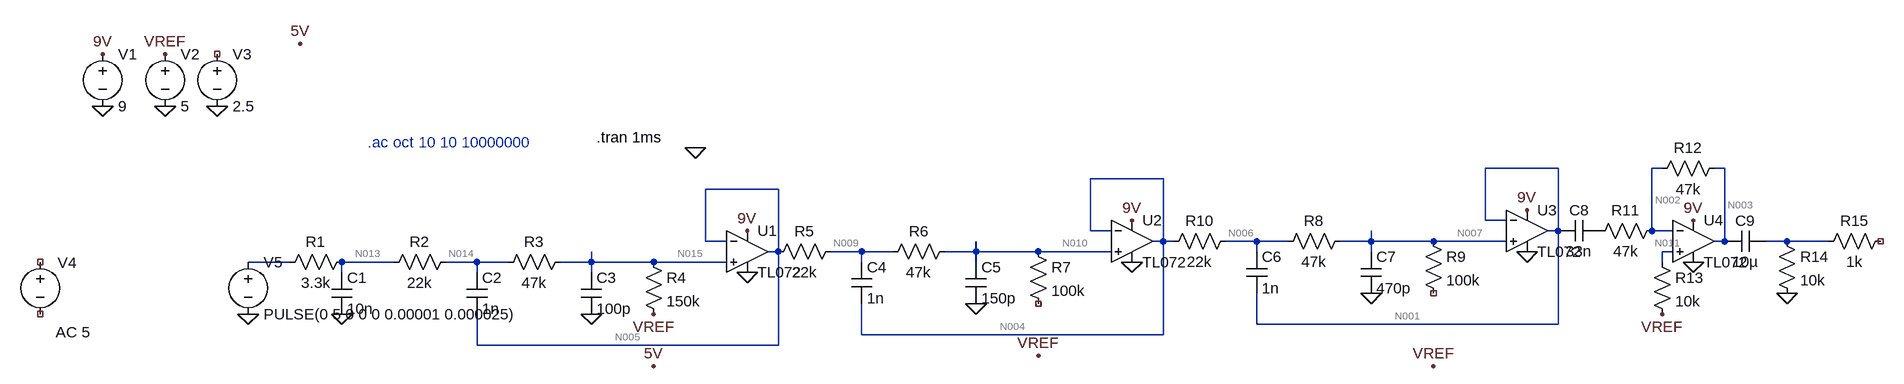
[diagram p0: schematic output.asc]
* output.asc
R1 N013 N012 3.3k
R2 N014 N013 22k
R3 N015 N014 47k
C1 N013 0 10n
C2 N014 N005 1n
C3 N015 0 100p
R4 N015 VREF 150k
V1 9V 0 9
V2 VREF 0 5
V3 NC_01 0 2.5
* U1: TL072 (symbol TL072 not available, pins judged from their places): In+=N015 In-=N005 V+=9V V-=0 OUT=N005
V4 NC_02 NC_03 AC 5
R5 N009 N005 22k
R6 N010 N009 47k
C4 N009 N004 1n
C5 N010 0 150p
R7 N010 NC_04 100k
* U2: TL072 (symbol TL072 not available, pins judged from their places): In+=N010 In-=N004 V+=9V V-=0 OUT=N004
R8 N007 N006 47k
C6 N006 N001 1n
C7 N007 0 470p
R9 N007 NC_05 100k
* U3: TL072 (symbol TL072 not available, pins judged from their places): In+=N007 In-=N001 V+=9V V-=0 OUT=N001
R10 N006 N004 22k
C8 P001 N001 33n
V5 N012 0 PULSE(0 5 0 0 0 0.00001 0.000025)
* U4: TL072 (symbol TL072 not available, pins judged from their places): In+=N011 In-=N002 V+=9V V-=0 OUT=N003
C9 N008 N003 10µ
R11 N002 P001 47k
R12 N003 N002 47k
R13 N011 VREF 10k
R14 N008 0 10k
R15 NC_06 N008 1k
* .ac oct 10 10 10000000
.tran 1ms
.backanno
.end

* Results of the author's LTspice run, read from the files saved beside the schematic
* Operating Point, zero values left out:
*   V(n013) = 74.22 mV
*   V(n014) = 569.1 mV
*   V(n015) = 1.626 V
*   V(n005) = 1.634 V
*   V(vref) = 5 V
*   V(9v) = 9 V
*   V(n009) = 1.634 V
*   V(n010) = 1.634 V
*   V(n004) = 1.641 V
*   V(n007) = 1.641 V
*   V(n006) = 1.641 V
*   V(n001) = 1.646 V
*   V(p001) = 5 V
*   V(n003) = 5 V
*   V(n002) = 5 V
*   V(n011) = 5 V
*   I(R1) = 22.49 µA
*   I(R2) = 22.49 µA
*   I(R3) = 22.49 µA
*   I(R4) = -22.49 µA
*   I(R5) = -31.67 pA
*   I(R6) = -31.67 pA
*   I(R8) = -31.68 pA
*   I(R10) = -31.68 pA
*   I(R12) = 35.05 pA
*   I(R13) = -35.05 pA
*   I(V1) = -17.58 mA
*   I(V2) = -22.49 µA
*   I(V5) = 22.49 µA
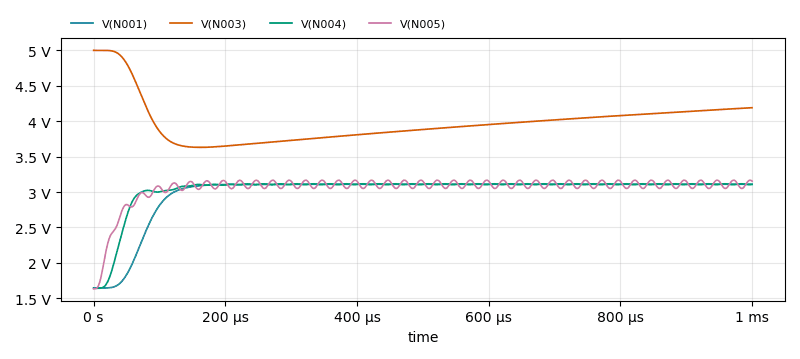
[diagram p1: Transient Analysis of output.asc, plotted from the saved traces]
* Transient Analysis, 1 run:
*   V(N001): min 1.646 V, max 3.111 V, average 2.993 V, rms 3.014 V, last 3.11 V
*   V(N003): min 3.631 V, max 5 V, average 3.984 V, rms 3.995 V, last 4.191 V
*   V(N004): min 1.641 V, max 3.117 V, average 3.041 V, rms 3.052 V, last 3.107 V
*   V(N005): min 1.634 V, max 3.168 V, average 3.057 V, rms 3.064 V, last 3.154 V